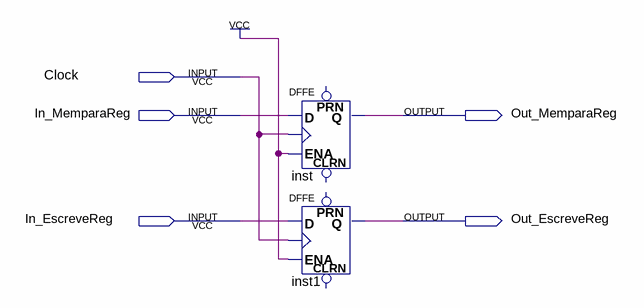
[diagram p0: schematic sheet]
// Quartus schematic MEM_WB_cont.bdf as structural Verilog: 2 symbols, 5 pins
module MEM_WB_cont (
  input  Clock,
  input  In_MemparaReg,
  input  In_EscreveReg,
  output Out_MemparaReg,
  output Out_EscreveReg
);

  DFFE inst (.D(In_MemparaReg), .CLK(Clock), .ENA(1'b1), .Q(Out_MemparaReg));  // open: PRN, CLRN
  DFFE inst1 (.D(In_EscreveReg), .CLK(Clock), .ENA(1'b1), .Q(Out_EscreveReg));  // open: PRN, CLRN
endmodule
